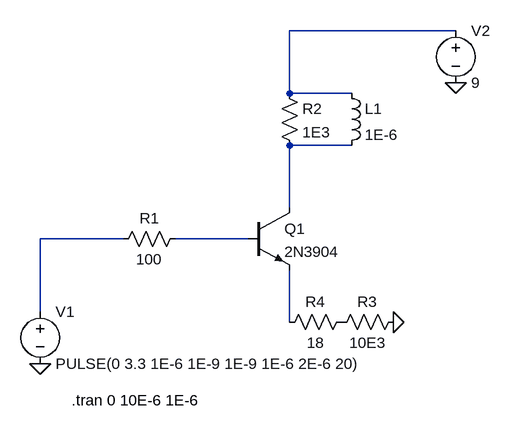
[diagram p0: schematic Buzzer2.asc]
Buzzer2.asc, the LTspice schematic file:
Version 4
SHEET 1 880 680
WIRE 752 -320 496 -320
WIRE 496 -224 496 -320
WIRE 592 -224 496 -224
WIRE 592 -144 496 -144
WIRE 496 -48 496 -144
WIRE 240 0 112 0
WIRE 432 0 320 0
WIRE 112 112 112 0
WIRE 496 128 496 48
FLAG 752 -240 0
FLAG 112 192 0
FLAG 656 128 0
DATAFLAG 368 0 ""
DATAFLAG 208 0 "I(R1)"
DATAFLAG 496 -96 ""
DATAFLAG 496 80 ""
DATAFLAG 672 -320 "I(V2)"
SYMBOL voltage 112 96 R0
WINDOW 123 0 0 Left 2
WINDOW 39 0 0 Left 2
SYMATTR InstName V1
SYMATTR Value PULSE(0 3.3 1E-6 1E-9 1E-9 1E-6 2E-6 20)
SYMBOL res 336 -16 R90
WINDOW 0 0 56 VBottom 2
WINDOW 3 32 56 VTop 2
SYMATTR InstName R1
SYMATTR Value 100
SYMBOL npn 432 -48 R0
SYMATTR InstName Q1
SYMATTR Value 2N3904
SYMBOL res 480 -240 R0
SYMATTR InstName R2
SYMATTR Value 1E3
SYMBOL ind 576 -240 R0
SYMATTR InstName L1
SYMATTR Value 1E-6
SYMBOL voltage 752 -336 R0
WINDOW 123 0 0 Left 2
WINDOW 39 0 0 Left 2
SYMATTR InstName V2
SYMATTR Value 9
SYMBOL res 592 112 R90
WINDOW 0 0 56 VBottom 2
WINDOW 3 32 56 VTop 2
SYMATTR InstName R4
SYMATTR Value 18
SYMBOL res 672 112 R90
WINDOW 0 0 56 VBottom 2
WINDOW 3 32 56 VTop 2
SYMATTR InstName R3
SYMATTR Value 10E3
TEXT 160 248 Left 2 !.tran 0 10E-6 1E-6

The netlist it stands for:
* Buzzer2.asc
V1 N003 0 PULSE(0 3.3 1E-6 1E-9 1E-9 1E-6 2E-6 20)
R1 N004 N003 100
Q1 N002 N004 N005 0 2N3904
R2 N001 N002 1E3
L1 N001 N002 1E-6
V2 N001 0 9
R4 P001 N005 18
R3 0 P001 10E3
.model NPN NPN
.model PNP PNP
.lib standard.bjt
.tran 0 10E-6 1E-6
.backanno
.end